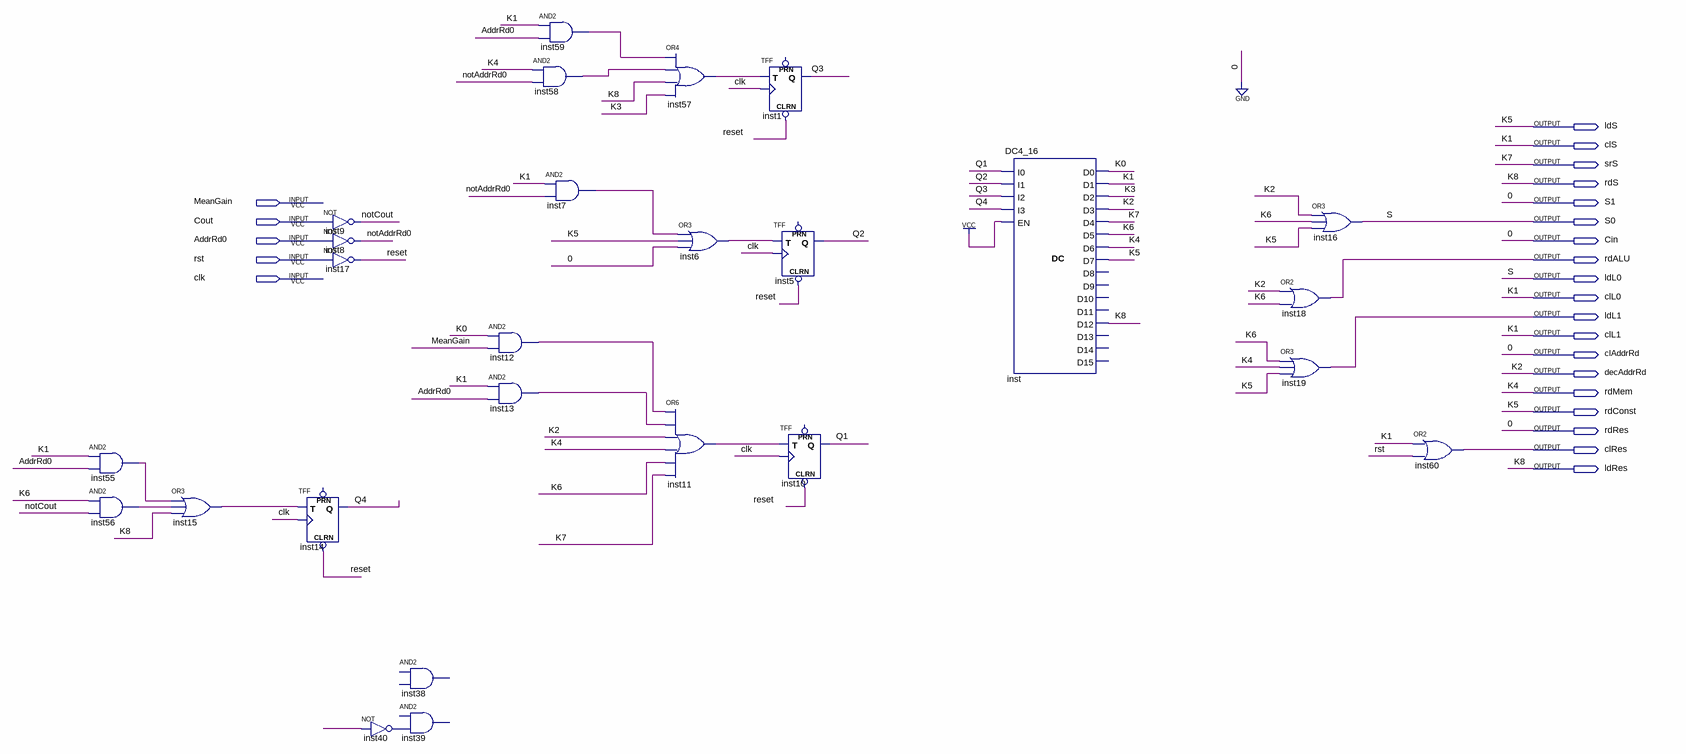
[diagram p0: schematic sheet]
// Quartus schematic MeanGain_upravljacka_jedinica.bdf as structural Verilog: 26 symbols, 24 pins
module MeanGain_upravljacka_jedinica (
  input  MeanGain,
  input  Cout,
  input  AddrRd0,
  input  rst,
  input  clk,
  output ldS,
  output clS,
  output srS,
  output rdS,
  output S1,
  output S0,
  output Cin,
  output rdALU,
  output ldL0,
  output clL0,
  output ldL1,
  output clL1,
  output clAddrRd,
  output decAddrRd,
  output rdMem,
  output rdConst,
  output rdRes,
  output clRes,
  output ldRes
);

  wire inst6_out, inst7_out, inst11_out, inst12_out, inst13_out, inst15_out, inst40_out, inst55_out,
       inst56_out, inst57_out, inst58_out, inst59_out, K0, K3, K6, notAddrRd0, notCout, Q1, Q2, Q3, Q4,
       reset, undriven;

  and inst55 (inst55_out, clL0, AddrRd0);
  and inst56 (inst56_out, K6, notCout);
  or inst15 (inst15_out, inst55_out, inst56_out, ldRes);
  TFF inst14 (.CLRN(reset), .T(inst15_out), .CLK(clk), .Q(Q4));  // open: PRN
  not inst9 (notCout, Cout);
  not inst8 (notAddrRd0, AddrRd0);
  not inst17 (reset, rst);
  // AND2 inst38 is placed but not wired
  // AND2 inst39 has open pins: IN1=open, IN2=inst40_out, OUT=open
  not inst40 (inst40_out, undriven);
  and inst12 (inst12_out, K0, MeanGain);
  and inst13 (inst13_out, clL0, AddrRd0);
  and inst59 (inst59_out, clL0, AddrRd0);
  and inst58 (inst58_out, rdMem, notAddrRd0);
  and inst7 (inst7_out, clL0, notAddrRd0);
  or inst57 (inst57_out, inst59_out, inst58_out, ldRes, K3);
  or inst6 (inst6_out, inst7_out, ldS, 1'b0);
  or inst11 (inst11_out, inst12_out, inst13_out, decAddrRd, rdMem, K6, srS);
  TFF inst1 (.CLRN(reset), .T(inst57_out), .CLK(clk), .Q(Q3));  // open: PRN
  TFF inst5 (.CLRN(reset), .T(inst6_out), .CLK(clk), .Q(Q2));  // open: PRN
  TFF inst10 (.CLRN(reset), .T(inst11_out), .CLK(clk), .Q(Q1));  // open: PRN
  DC4_16 inst (
    .I0(Q1), .I1(Q2), .I2(Q3), .I3(Q4), .EN(1'b1), .D0(K0), .D1(clL0), .D2(K3), .D3(decAddrRd), .D4(srS),
    .D5(K6), .D6(rdMem), .D7(ldS), .D12(ldRes));  // open: D8, D9, D10, D11, D13, D14, D15
  or inst16 (ldL0, decAddrRd, K6, ldS);
  or inst18 (rdALU, decAddrRd, K6);
  or inst19 (ldL1, K6, rdMem, ldS);
  or inst60 (clRes, clL0, rst);

  assign Cin = 1'b0;
  assign clAddrRd = 1'b0;
  assign clL1 = clL0;
  assign clS = clL0;
  assign rdConst = ldS;
  assign rdRes = 1'b0;
  assign rdS = ldRes;
  assign S0 = ldL0;
  assign S1 = 1'b0;

  // Other names for the same wires on the sheet: K1 = clL0; K2 = decAddrRd; K4 = rdMem; K5 = ldS; K7 = srS;
  //   K8 = ldRes; S = ldL0
endmodule
